# EAGLE design main_board (EAGLE 9.6.2)
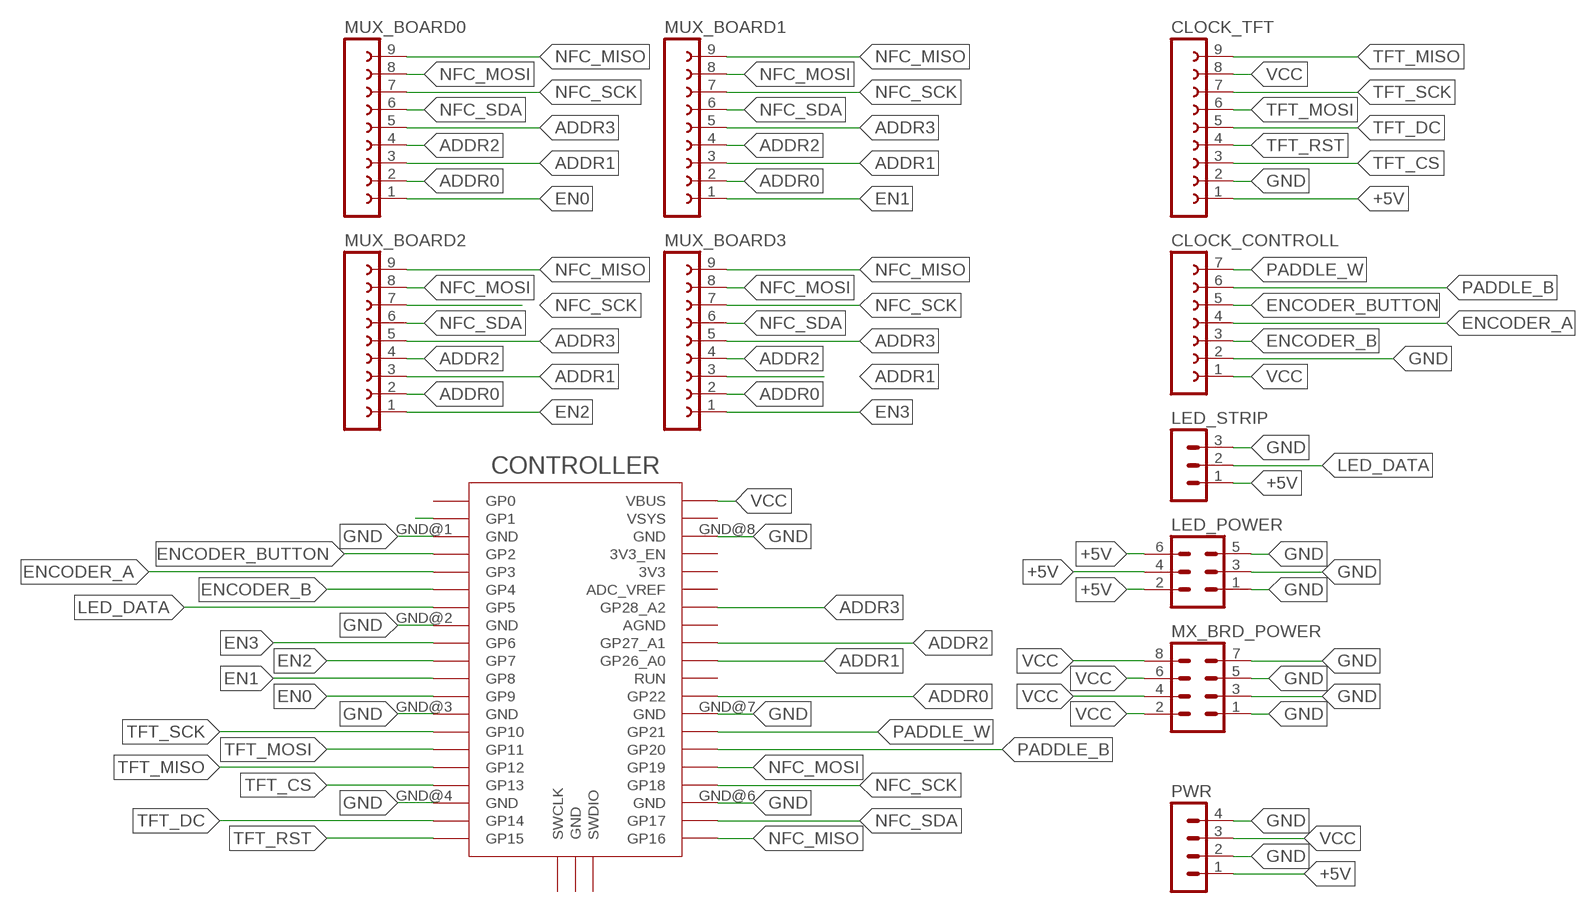
[diagram p0: schematic, sheet 1]

## Parts
CLOCK_CONTROLL  FE07-1  [FE07]
CLOCK_TFT  FE09-1  [FE09]
CONTROLLER  RPI_PICO_IG-TH  [RPI_PICO_TH]
LED_POWER  MA03-2  [MA03-2]
LED_STRIP  MA03-1  [MA03-1]
MUX_BOARD0  FE09-1  [FE09]
MUX_BOARD1  FE09-1  [FE09]
MUX_BOARD2  FE09-1  [FE09]
MUX_BOARD3  FE09-1  [FE09]
MX_BRD_POWER  MA04-2  [MA04-2]
PWR  MA04-1  [MA04-1]

## Nets
+5V: CLOCK_TFT.1 LED_POWER.2 LED_POWER.4 LED_POWER.6 LED_STRIP.1 PWR.1
ADDR0: CONTROLLER.GP22 MUX_BOARD0.2 MUX_BOARD1.2 MUX_BOARD2.2 MUX_BOARD3.2
ADDR1: CONTROLLER.GP26_A0 MUX_BOARD0.3 MUX_BOARD1.3 MUX_BOARD2.3 MUX_BOARD3.3
ADDR2: CONTROLLER.GP27_A1 MUX_BOARD0.4 MUX_BOARD1.4 MUX_BOARD2.4 MUX_BOARD3.4
ADDR3: CONTROLLER.GP28_A2 MUX_BOARD0.5 MUX_BOARD1.5 MUX_BOARD2.5 MUX_BOARD3.5
EN0: CONTROLLER.GP9 MUX_BOARD0.1
EN1: CONTROLLER.GP8 MUX_BOARD1.1
EN2: CONTROLLER.GP7 MUX_BOARD2.1
EN3: CONTROLLER.GP6 MUX_BOARD3.1
ENCODER_A: CLOCK_CONTROLL.4 CONTROLLER.GP3
ENCODER_B: CLOCK_CONTROLL.3 CONTROLLER.GP4
ENCODER_BUTTON: CLOCK_CONTROLL.5 CONTROLLER.GP2
GND: CLOCK_CONTROLL.2 CLOCK_TFT.2 CONTROLLER.GND@1(GND) CONTROLLER.GND@2(GND) CONTROLLER.GND@3(GND) CONTROLLER.GND@4(GND) CONTROLLER.GND@6(GND) CONTROLLER.GND@7(GND) CONTROLLER.GND@8(GND) LED_POWER.1 LED_POWER.3 LED_POWER.5 LED_STRIP.3 MX_BRD_POWER.1 MX_BRD_POWER.3 MX_BRD_POWER.5 MX_BRD_POWER.7 PWR.2 PWR.4
LED_DATA: CONTROLLER.GP5 LED_STRIP.2
N$2: CONTROLLER.GP1
NFC_MISO: CONTROLLER.GP16 MUX_BOARD0.9 MUX_BOARD1.9 MUX_BOARD2.9 MUX_BOARD3.9
NFC_MOSI: CONTROLLER.GP19 MUX_BOARD0.8 MUX_BOARD1.8 MUX_BOARD2.8 MUX_BOARD3.8
NFC_SCK: CONTROLLER.GP18 MUX_BOARD0.7 MUX_BOARD1.7 MUX_BOARD2.7 MUX_BOARD3.7
NFC_SDA: CONTROLLER.GP17 MUX_BOARD0.6 MUX_BOARD1.6 MUX_BOARD2.6 MUX_BOARD3.6
PADDLE_B: CLOCK_CONTROLL.6 CONTROLLER.GP20
PADDLE_W: CLOCK_CONTROLL.7 CONTROLLER.GP21
TFT_CS: CLOCK_TFT.3 CONTROLLER.GP13
TFT_DC: CLOCK_TFT.5 CONTROLLER.GP14
TFT_MISO: CLOCK_TFT.9 CONTROLLER.GP12
TFT_MOSI: CLOCK_TFT.6 CONTROLLER.GP11
TFT_RST: CLOCK_TFT.4 CONTROLLER.GP15
TFT_SCK: CLOCK_TFT.7 CONTROLLER.GP10
VCC: CLOCK_CONTROLL.1 CLOCK_TFT.8 CONTROLLER.VBUS MX_BRD_POWER.2 MX_BRD_POWER.4 MX_BRD_POWER.6 MX_BRD_POWER.8 PWR.3
Unconnected: CONTROLLER.3V3 CONTROLLER.3V3_EN CONTROLLER.ADC_VREF CONTROLLER.AGND CONTROLLER.GND@5(GND) CONTROLLER.GP0 CONTROLLER.RUN CONTROLLER.SWCLK CONTROLLER.SWDIO CONTROLLER.VSYS

## Library data of the parts
CLOCK_CONTROLL = con-lsta:FE07-1: FEMALE HEADER; OC_FARNELL: unknown; OC_NEWARK: unknown
CLOCK_TFT MUX_BOARD0 MUX_BOARD1-MUX_BOARD3 = con-lsta:FE09-1: FEMALE HEADER; OC_FARNELL: unknown; OC_NEWARK: unknown
CONTROLLER = RaspberryPi_Pico:RPI_PICO_IG
LED_POWER = con-lstb:MA03-2: PIN HEADER; OC_FARNELL: unknown; OC_NEWARK: unknown
LED_STRIP = con-lstb:MA03-1: PIN HEADER; OC_FARNELL: unknown; OC_NEWARK: unknown
MX_BRD_POWER = con-lstb:MA04-2: PIN HEADER; OC_FARNELL: unknown; OC_NEWARK: unknown
PWR = con-lstb:MA04-1: PIN HEADER; OC_FARNELL: unknown; OC_NEWARK: unknown

## Board
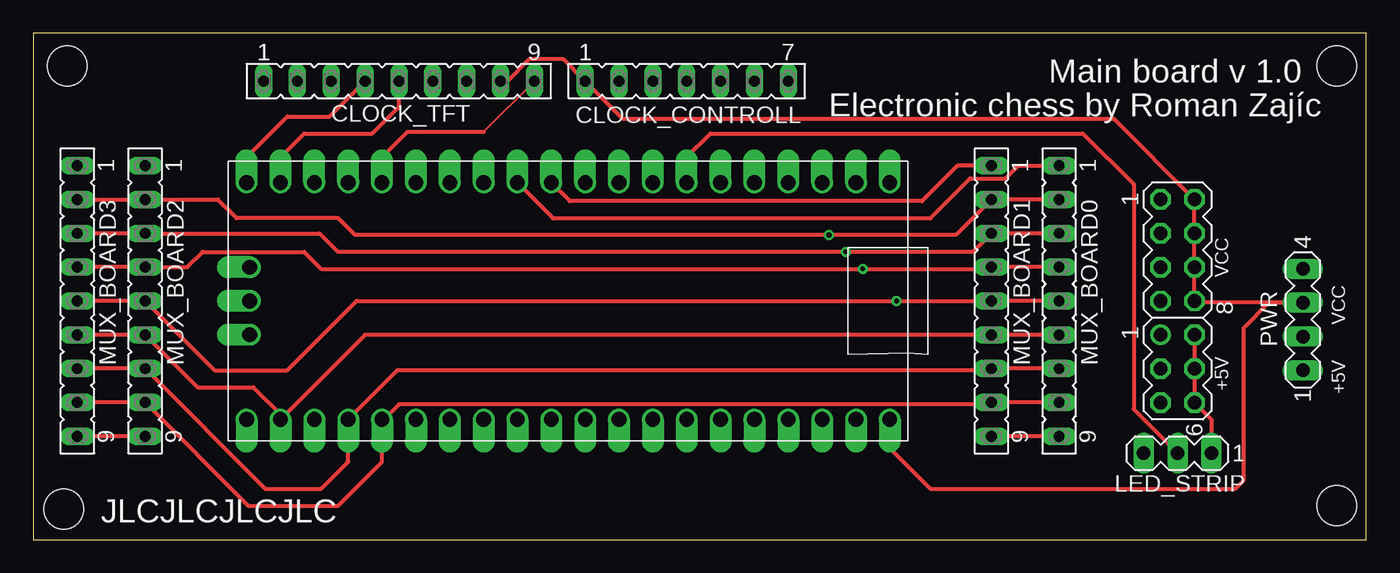
[diagram p1: board, top side]
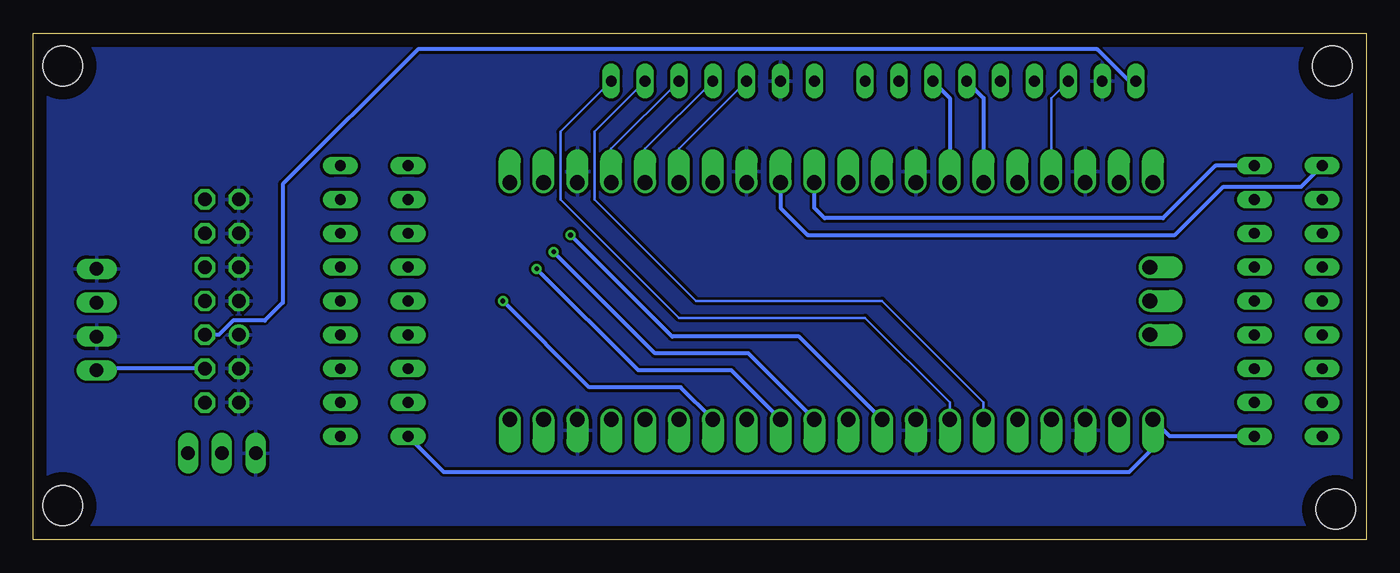
[diagram p2: board, bottom side, seen from below]

Size 100 x 38 mm. Coordinates in mm from the lower left corner, seen from the top.
Outline: 0,0 100,0 100,38 0,38 0,0
Copper layers (1*16): Top 0.035mm / dielectric 1.5mm / Bottom 0.035mm
Design rules "default *": minimum track width 6mil, minimum drill 0.35mm, track to track 6mil, track to pad 6mil, pad to pad 6mil, via to via 6mil, smd to smd 6mil, copper to edge 40mil, drill to drill 6mil, minimum pad ring 10mil, minimum via ring 8mil, stop-mask expansion 4mil, vias tented up to drill 0mil, thermal gap 10mil
Holes 3 mm at 97.79,35.56 97.79,2.54 2.54,35.56 2.29,2.29

### Footprints (pad centres in the part's own frame; a part is rotated, then mirrored left to right if it is on the bottom)
FE07 = drill 0.813 long: 1 -7.62,0; 2 -5.08,0; 3 -2.54,0; 4 0,0; 5 2.54,0; 6 5.08,0; 7 7.62,0
FE09 = drill 0.813 long: 1 -10.16,0; 2 -7.62,0; 3 -5.08,0; 4 -2.54,0; 5 0,0; 6 2.54,0; 7 5.08,0; 8 7.62,0; 9 10.16,0
RPI_PICO_TH = drill 1.1 pad 1.6 offset: 3V3 8.89,13.97; 3V3_EN 8.89,16.51; ADC_VREF 8.89,11.43; AGND 8.89,6.35; GND@1 -8.89,19.05; GND@2 -8.89,6.35; GND@3 -8.89,-6.35; GND@4 -8.89,-19.05; GND@5 0,-23.9; GND@6 8.89,-19.05; GND@7 8.89,-6.35; GND@8 8.89,19.05; GP0 -8.89,24.13; GP1 -8.89,21.59; GP2 -8.89,16.51; GP3 -8.89,13.97; GP4 -8.89,11.43; GP5 -8.89,8.89; GP6 -8.89,3.81; GP7 -8.89,1.27; GP8 -8.89,-1.27; GP9 -8.89,-3.81; GP10 -8.89,-8.89; GP11 -8.89,-11.43; GP12 -8.89,-13.97; GP13 -8.89,-16.51; GP14 -8.89,-21.59; GP15 -8.89,-24.13; GP16 8.89,-24.13; GP17 8.89,-21.59; GP18 8.89,-16.51; GP19 8.89,-13.97; GP20 8.89,-11.43; GP21 8.89,-8.89; GP22 8.89,-3.81; GP26_A0 8.89,1.27; GP27_A1 8.89,3.81; GP28_A2 8.89,8.89; RUN 8.89,-1.27; SWCLK -2.54,-23.9; SWDIO 2.54,-23.9; VBUS 8.89,24.13; VSYS 8.89,21.59
MA03-2 = drill 1.016: 1 -2.54,-1.27 | drill 1.016 octagon: 2 -2.54,1.27; 3 0,-1.27; 4 0,1.27; 5 2.54,-1.27; 6 2.54,1.27
MA03-1 = drill 1.016 long: 1 -2.54,0; 2 0,0; 3 2.54,0
MA04-2 = drill 1.016 octagon: 1 -3.81,-1.27; 2 -3.81,1.27; 3 -1.27,-1.27; 4 -1.27,1.27; 5 1.27,-1.27; 6 1.27,1.27; 7 3.81,-1.27; 8 3.81,1.27
MA04-1 = drill 1.016 long: 1 -3.81,0; 2 -1.27,0; 3 1.27,0; 4 3.81,0

### Placement (x,y rotation side)
CLOCK_CONTROLL  49.02,34.42 0 top
CLOCK_TFT  27.43,34.42 0 top
CONTROLLER  40.13,17.91 270 top
LED_POWER  85.85,12.83 270 top
LED_STRIP  85.85,6.48 180 top
MUX_BOARD0  76.96,17.91 270 top
MUX_BOARD1  71.88,17.91 270 top
MUX_BOARD2  8.38,17.91 270 top
MUX_BOARD3  3.3,17.91 270 top
MX_BRD_POWER  85.85,21.72 270 top
PWR  95.25,16.51 90 top

### Tracks (layer width: path | path; a pad name or v marks a point on that pad's centre or on a via)
+5V
  Top 0.305: LED_POWER.2 LED_POWER.4 LED_POWER.6 88.39,9.02 LED_STRIP.1
  Bottom 0.305: LED_POWER.2 86.09,15.37 85.02,16.43 82.63,16.43 81.28,17.78 81.28,26.67 71.14,36.8 20.17,36.8 17.79,34.42 CLOCK_TFT.1 | LED_POWER.4 95.12,12.83 PWR.1
ADDR0  (via drill 0.35)
  Top 0.305: MUX_BOARD0.2 MUX_BOARD1.2 69.22,22.86 v59.69,22.86 24.13,22.86 22.86,24.13 15.24,24.13 13.84,25.53 MUX_BOARD2.2 MUX_BOARD3.2
  Bottom 0.305: CONTROLLER.GP22 42.55,15.24 52.07,15.24 v59.69,22.86
ADDR1  (via drill 0.35)
  Top 0.305: MUX_BOARD0.3 MUX_BOARD1.3 70.48,21.59 v60.96,21.59 22.86,21.59 21.46,22.99 MUX_BOARD2.3 MUX_BOARD3.3
  Bottom 0.305: CONTROLLER.GP26_A0 46.35,13.97 53.34,13.97 v60.96,21.59
ADDR2  (via drill 0.35)
  Top 0.305: MUX_BOARD0.4 72.39,20.45 | 72.39,20.45 MUX_BOARD1.4 | MUX_BOARD3.4 MUX_BOARD2.4 11.56,20.45 12.7,21.59 20.32,21.59 21.59,20.32 v62.23,20.32 72.26,20.32 72.39,20.45
  Bottom 0.305: CONTROLLER.GP27_A1 47.62,12.7 54.61,12.7 v62.23,20.32
ADDR3  (via drill 0.35)
  Top 0.305: MUX_BOARD0.5 MUX_BOARD1.5 v64.77,17.91 24.26,17.91 19.05,12.7 13.59,12.7 MUX_BOARD2.5 MUX_BOARD3.5
  Bottom 0.305: CONTROLLER.GP28_A2 51.44,11.43 58.29,11.43 v64.77,17.91
EN0
  Top 0.305: CONTROLLER.GP9 38.99,24.13 67.31,24.13 70.28,27.1 72.94,27.1 73.91,28.07 MUX_BOARD0.1
EN1
  Top 0.305: MUX_BOARD1.1 69.34,28.07 66.67,25.4 40.26,25.4 CONTROLLER.GP8
EN2
  Bottom 0.305: MUX_BOARD2.1 11.3,28.07 15.24,24.13 40.64,24.13 41.4,24.89 CONTROLLER.GP7
EN3
  Bottom 0.305: CONTROLLER.GP6 43.94,24.89 41.91,22.86 14.34,22.86 10.71,26.49 4.88,26.49 MUX_BOARD3.1
ENCODER_A
  Bottom 0.203: CLOCK_CONTROLL.4 54.1,29.34 CONTROLLER.GP3
ENCODER_B
  Bottom 0.203: CLOCK_CONTROLL.3 51.56,29.34 CONTROLLER.GP4
ENCODER_BUTTON
  Bottom 0.203: CLOCK_CONTROLL.5 56.64,29.34 CONTROLLER.GP2
GND
  pour Bottom (isolate 0.2): -1.27,38.1 -1.27,-1.27 101.6,-1.27 101.6,39.37 -1.27,39.37
LED_DATA
  Top 0.305: CONTROLLER.GP5 49.02,28.7 50.8,30.48 78.74,30.48 82.55,26.67 82.55,9.78 LED_STRIP.2
NFC_MISO
  Top 0.305: MUX_BOARD0.9 MUX_BOARD1.9 | MUX_BOARD2.9 MUX_BOARD3.9
  Bottom 0.305: MUX_BOARD1.9 69.22,5.08 31.75,5.08 17.78,5.08 16,6.86 CONTROLLER.GP16 14.73,7.75 MUX_BOARD2.9
NFC_MOSI
  Top 0.305: MUX_BOARD0.8 MUX_BOARD1.8 71.75,10.16 27.43,10.16 26.16,8.89 | MUX_BOARD3.8 MUX_BOARD2.8 16.13,2.54 22.86,2.54 26.16,5.84 26.16,8.89 | 26.16,8.89 CONTROLLER.GP19
NFC_SCK
  Top 0.305: MUX_BOARD0.7 MUX_BOARD1.7 71.75,12.7 27.3,12.7 CONTROLLER.GP18 23.62,5.84 21.59,3.81 17.4,3.81 MUX_BOARD2.7 MUX_BOARD3.7
NFC_SDA
  Top 0.305: MUX_BOARD0.6 MUX_BOARD1.6 24.89,15.37 CONTROLLER.GP17 18.54,9.4 16.51,11.43 12.32,11.43 MUX_BOARD2.6 MUX_BOARD3.6
PADDLE_B
  Bottom 0.203: CLOCK_CONTROLL.6 57.91,30.61 57.91,25.53 50.29,17.91 36.32,17.91 28.7,10.29 CONTROLLER.GP20
PADDLE_W
  Bottom 0.203: CLOCK_CONTROLL.7 60.45,30.61 60.45,25.53 51.56,16.64 37.59,16.64 31.24,10.29 CONTROLLER.GP21
TFT_CS
  Bottom 0.203: CLOCK_TFT.3 23.62,33.15 CONTROLLER.GP13
TFT_DC
  Top 0.305: CONTROLLER.GP14 18.54,28.7 20.32,30.48 25.4,30.48 27.43,32.51 CLOCK_TFT.5
TFT_MISO
  Top 0.203: 33.78,30.61 CLOCK_TFT.9
  Top 0.305: CONTROLLER.GP12 26.16,28.7 28.07,30.61 33.78,30.61
TFT_MOSI
  Bottom 0.305: CLOCK_TFT.6 28.7,33.15 CONTROLLER.GP11
TFT_RST
  Top 0.305: CONTROLLER.GP15 16,28.7 19.05,31.75 22.23,31.75 CLOCK_TFT.4
TFT_SCK
  Bottom 0.305: CLOCK_TFT.7 31.24,33.15 CONTROLLER.GP10
VCC
  Top 0.305: CLOCK_TFT.8 35.57,34.42 37.19,36.04 39.78,36.04 CLOCK_CONTROLL.1 44.26,31.56 81.09,31.56 MX_BRD_POWER.2 MX_BRD_POWER.4 MX_BRD_POWER.6 MX_BRD_POWER.8 87.12,17.78 PWR.3 92.71,17.78 90.81,15.88 90.81,4.45 90.17,3.81 67.31,3.81 64.26,6.86 CONTROLLER.VBUS

### Text on the board
tPlace: JLCJLCJLCJLC
tNames: Main board v 1.0 | Electronic chess by Roman Zajíc | VCC | VCC | +5V | +5V